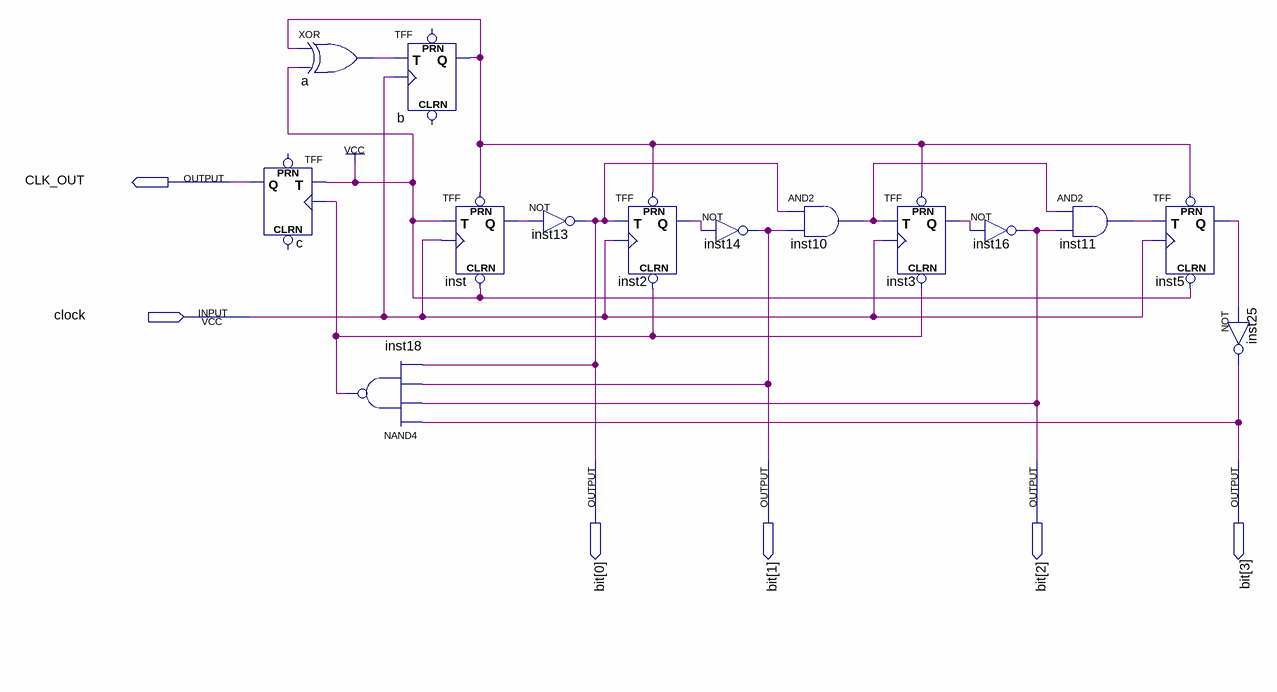
[diagram p0: schematic sheet]
// Quartus schematic count10.bdf as structural Verilog: 14 symbols, 6 pins
module count10 (
  input  clock,
  output CLK_OUT,
  output [3:0] \bit 
);

  wire a_out, b_q, inst2_q, inst3_q, inst5_q, inst10_out, inst11_out, inst18_out, inst_q;

  TFF c (.T(1'b1), .CLK(inst18_out), .Q(CLK_OUT));  // open: PRN, CLRN
  xor a (a_out, b_q, 1'b1);
  nand inst18 (inst18_out, \bit [3], \bit [2], \bit [1], \bit [0]);
  TFF b (.T(a_out), .CLK(clock), .Q(b_q));  // open: PRN, CLRN
  TFF inst (.PRN(b_q), .CLRN(1'b1), .T(1'b1), .CLK(clock), .Q(inst_q));
  not inst13 (\bit [0], inst_q);
  TFF inst2 (.PRN(b_q), .CLRN(inst18_out), .T(\bit [0]), .CLK(clock), .Q(inst2_q));
  not inst14 (\bit [1], inst2_q);
  and inst10 (inst10_out, \bit [0], \bit [1]);
  TFF inst3 (.PRN(b_q), .CLRN(inst18_out), .T(inst10_out), .CLK(clock), .Q(inst3_q));
  not inst16 (\bit [2], inst3_q);
  and inst11 (inst11_out, inst10_out, \bit [2]);
  TFF inst5 (.PRN(b_q), .CLRN(1'b1), .T(inst11_out), .CLK(clock), .Q(inst5_q));
  not inst25 (\bit [3], inst5_q);
endmodule
